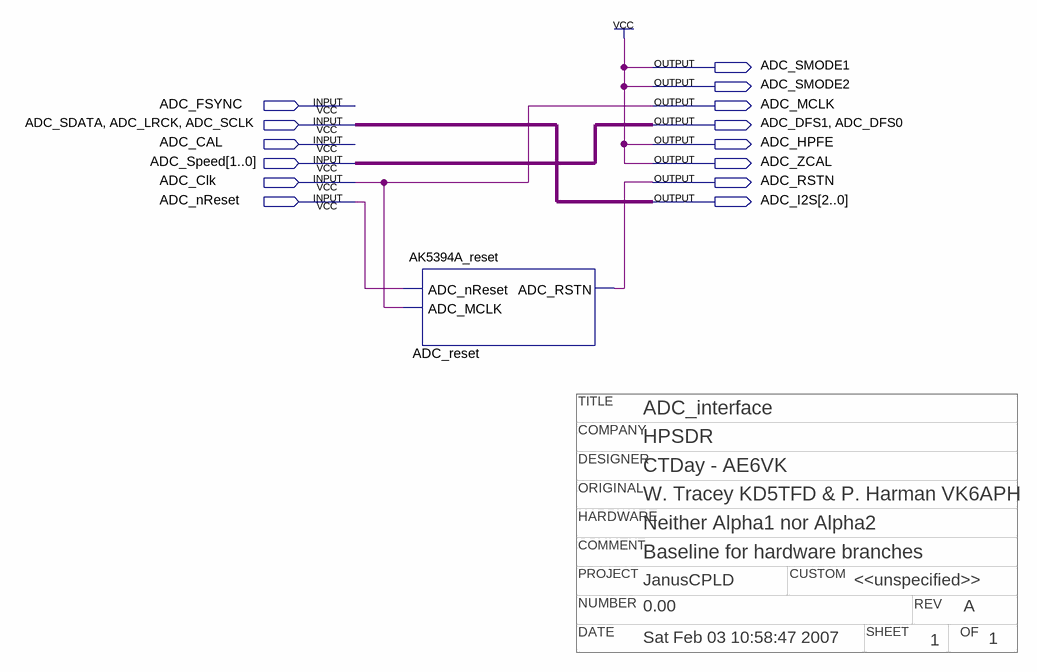
[diagram p0: schematic sheet]
// Quartus schematic ADC_interface.bdf as structural Verilog: 1 symbols, 14 pins
// Title block: TITLE: ADC_interface; COMPANY: HPSDR; DESIGNER: CTDay - AE6VK; NUMBER: 0.00; REV: A; DATE: Sat Feb 03 10:58:47 2007; SHEET: 1; OF: 1; ORIGINAL: W. Tracey KD5TFD & P. Harman VK6APH; HARDWARE: Neither Alpha1 nor Alpha2; COMMENT: Baseline for hardware branches; PROJECT: JanusCPLD; CUSTOM: <<unspecified>>
module ADC_interface (
  input  ADC_FSYNC,
  input  ADC_SDATA,
  input  ADC_LRCK,
  input  ADC_SCLK,
  input  ADC_CAL,
  input  [1:0] ADC_Speed,
  input  ADC_Clk,
  input  ADC_nReset,
  output ADC_SMODE1,
  output ADC_SMODE2,
  output ADC_MCLK,
  output ADC_DFS1,
  output ADC_DFS0,
  output ADC_HPFE,
  output ADC_ZCAL,
  output ADC_RSTN,
  output [2:0] ADC_I2S
);

  AK5394A_reset ADC_reset (.ADC_nReset(ADC_nReset), .ADC_MCLK(ADC_Clk), .ADC_RSTN(ADC_RSTN));

  assign ADC_DFS0 = ADC_Speed[0];
  assign ADC_DFS1 = ADC_Speed[1];
  assign ADC_HPFE = 1'b1;
  assign ADC_I2S = {ADC_SDATA, ADC_LRCK, ADC_SCLK};
  assign ADC_MCLK = ADC_Clk;
  assign ADC_SMODE1 = 1'b1;
  assign ADC_SMODE2 = 1'b1;
  assign ADC_ZCAL = 1'b1;
endmodule
